# Altium schematic sheet uARM.SchDoc: UARM
size OrCAD B; CheckedBy: KEVIN COTTON ING; Author: SAMUEL DUCLOS; CompanyName: CEGEP LIMOILOU; DrawnBy: SAMUEL DUCLOS; Organization: CEGEP LIMOILOU; Revision: A
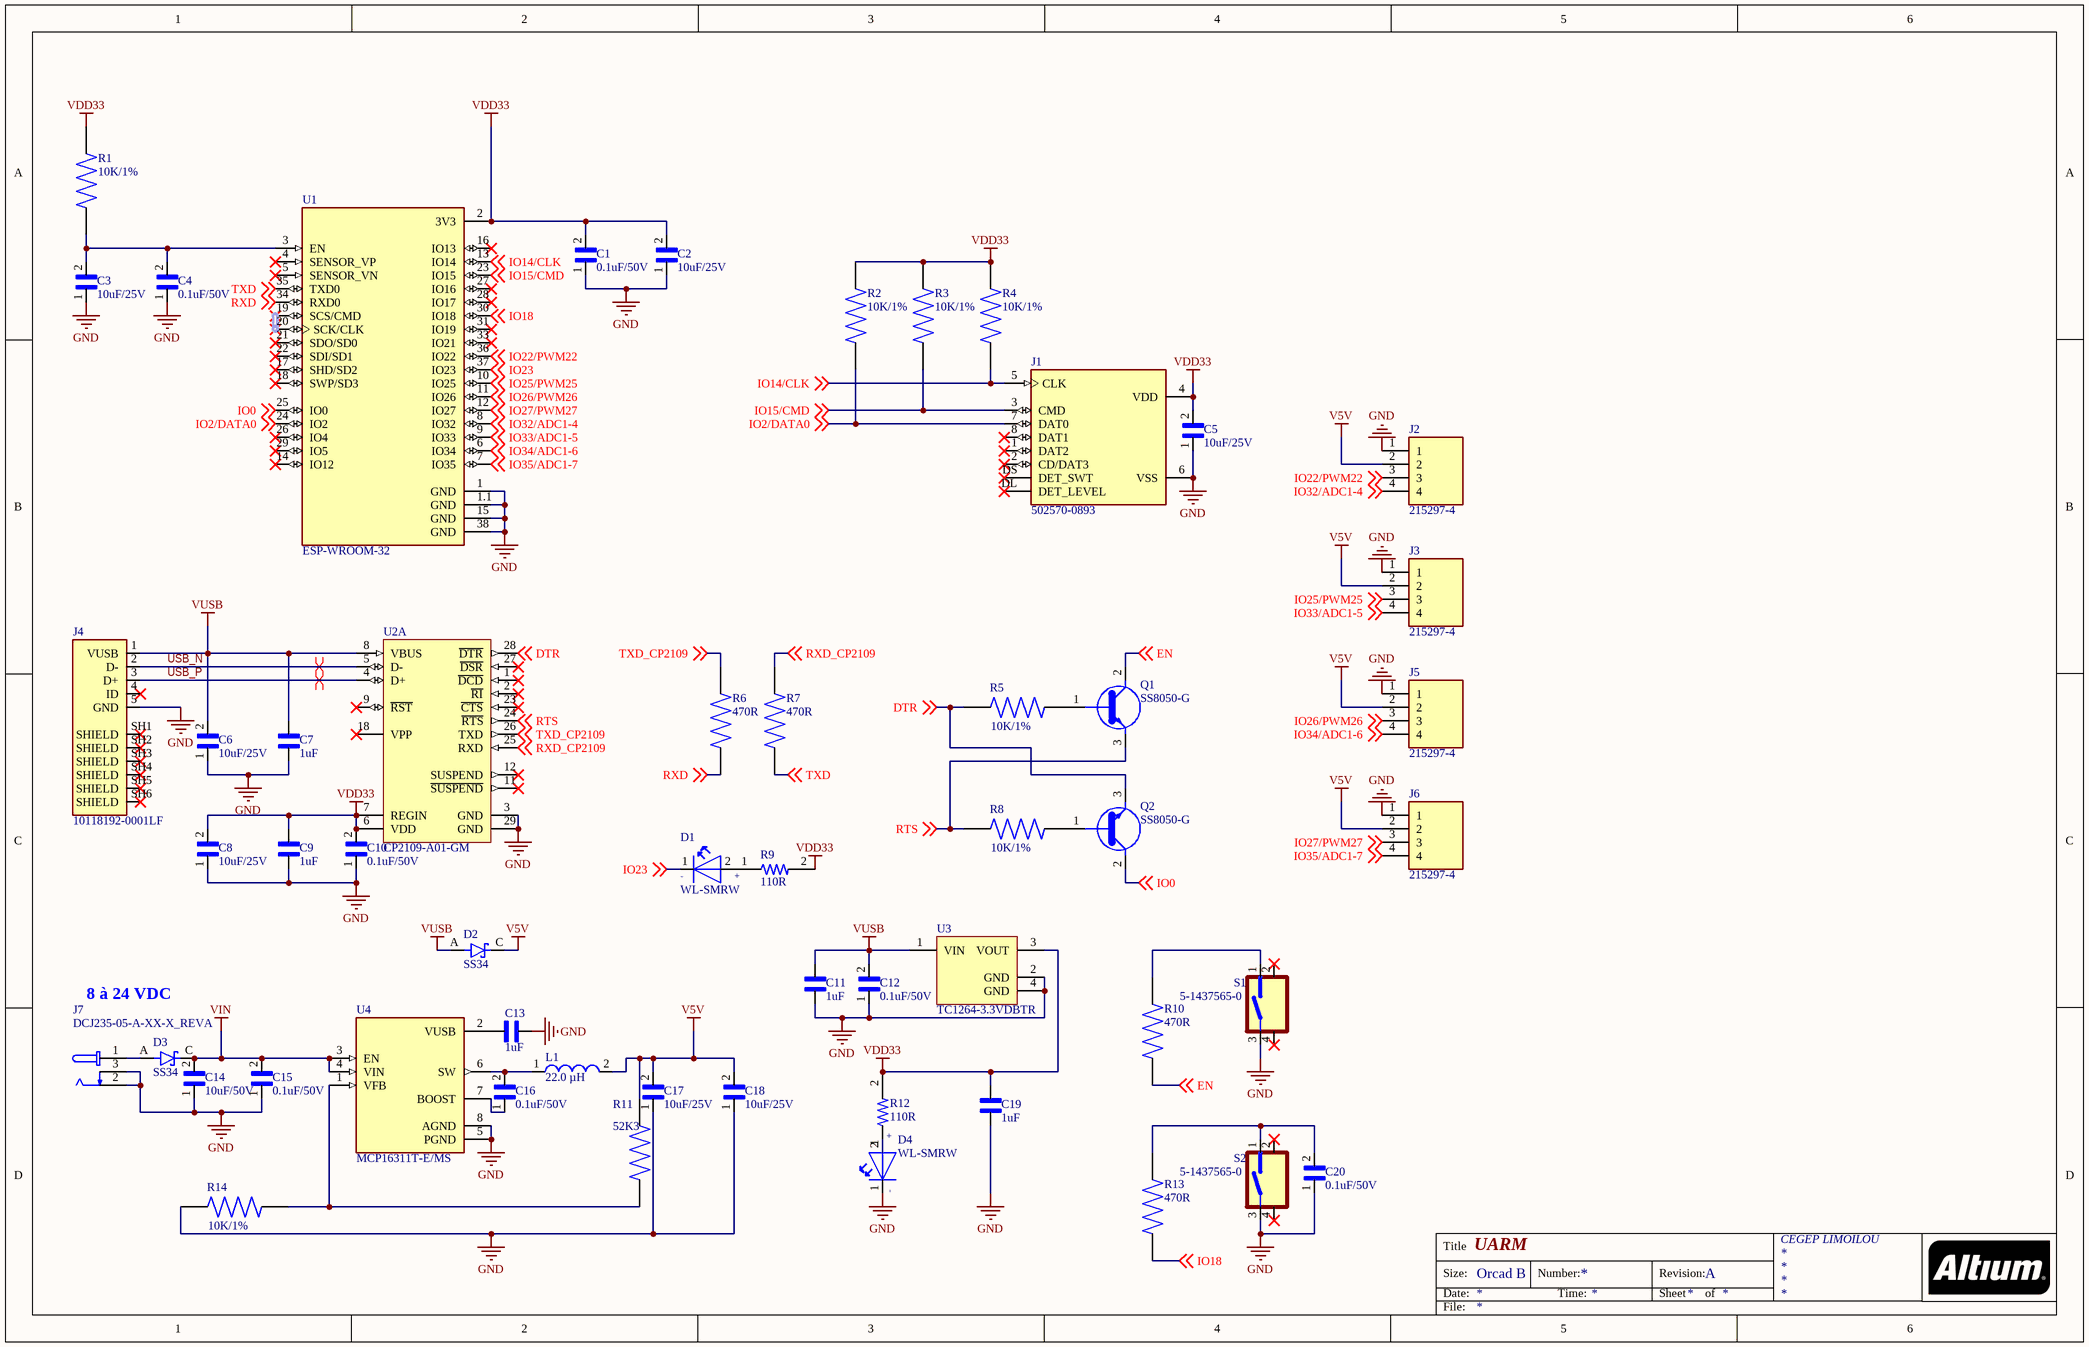
[diagram p0: uARM.SchDoc]

## Parts
C1  value 0.1uF/50V  [CAPC2012X94N]  (hidden comment: 08055C104KAT4A)
C2  value 10uF/25V  [CAPC2012X135N]  (hidden comment: CL21A106KAYNNNE)
C3  value 10uF/25V  [CAPC2012X135N]  (hidden comment: CL21A106KAYNNNE)
C4  value 0.1uF/50V  [CAPC2012X94N]  (hidden comment: 08055C104KAT4A)
C5  value 10uF/25V  [CAPC2012X135N]  (hidden comment: CL21A106KAYNNNE)
C6  value 10uF/25V  [CAPC2012X135N]  (hidden comment: CL21A106KAYNNNE)
C7  value 1uF  [WCAP-CSGP_885012207022]  (hidden comment: 885012207022)
C8  value 10uF/25V  [CAPC2012X135N]  (hidden comment: CL21A106KAYNNNE)
C9  value 1uF  [WCAP-CSGP_885012207022]  (hidden comment: 885012207022)
C10  value 0.1uF/50V  [CAPC2012X94N]  (hidden comment: 08055C104KAT4A)
C11  value 1uF  [WCAP-CSGP_885012207022]  (hidden comment: 885012207022)
C12  value 0.1uF/50V  [CAPC2012X94N]  (hidden comment: 08055C104KAT4A)
C13  value 1uF  [WCAP-CSGP_885012207022]  (hidden comment: 885012207022)
C14  value 10uF/50V  [CAPC2012X145N]  (hidden comment: GRM21BR61H106KE43L)
C15  value 0.1uF/50V  [CAPC2012X94N]  (hidden comment: 08055C104KAT4A)
C16  value 0.1uF/50V  [CAPC2012X94N]  (hidden comment: 08055C104KAT4A)
C17  value 10uF/25V  [CAPC2012X135N]  (hidden comment: CL21A106KAYNNNE)
C18  value 10uF/25V  [CAPC2012X135N]  (hidden comment: CL21A106KAYNNNE)
C19  value 1uF  [WCAP-CSGP_885012207022]  (hidden comment: 885012207022)
C20  value 0.1uF/50V  [CAPC2012X94N]  (hidden comment: 08055C104KAT4A)
D1  WL-SMRW  [WL-SMRW-1206-RECT]
D2  SS34  [DIOM7959X265N]
D3  SS34  [DIOM7959X265N]
D4  WL-SMRW  [WL-SMRW-1206-RECT]
J1  502570-0893  [MOLEX_502570-0893]
J2  215297-4  [TE_215297-4]
J3  215297-4  [TE_215297-4]
J4  10118192-0001LF  [AMPHENOL_10118192-0001LF]
J5  215297-4  [TE_215297-4]
J6  215297-4  [TE_215297-4]
J7  DCJ235-05-A-XX-X_REVA  [GCT_DCJ235-05-A-XX-X_REVA]
L1  Inductance: 22.0 µH  [WE-PD2-S]  (hidden comment: 744773122)
Q1  SS8050-G  [MBTB-T-SOT23]
Q2  SS8050-G  [MBTB-T-SOT23]
R1  value 10K/1%  [RESC2012X65N]  (hidden comment: ESR10EZPF1002)
R2  value 10K/1%  [RESC2012X65N]  (hidden comment: ESR10EZPF1002)
R3  value 10K/1%  [RESC2012X65N]  (hidden comment: ESR10EZPF1002)
R4  value 10K/1%  [RESC2012X65N]  (hidden comment: ESR10EZPF1002)
R5  value 10K/1%  [RESC2012X65N]  (hidden comment: ESR10EZPF1002)
R6  value 470R  [RESC2012X70N]  (hidden comment: ERJ-PB6B4700V)
R7  value 470R  [RESC2012X70N]  (hidden comment: ERJ-PB6B4700V)
R8  value 10K/1%  [RESC2012X65N]  (hidden comment: ESR10EZPF1002)
R9  value 110R  [RESCAV127P508X200X70-8N]  (hidden comment: RK73H2ATTD1100F)
R10  value 470R  [RESC2012X70N]  (hidden comment: ERJ-PB6B4700V)
R11  value 52K3  [RESC0603X26N]  (hidden comment: ERJ-1GEF5232C)
R12  value 110R  [RESCAV127P508X200X70-8N]  (hidden comment: RK73H2ATTD1100F)
R13  value 470R  [RESC2012X70N]  (hidden comment: ERJ-PB6B4700V)
R14  value 10K/1%  [RESC2012X65N]  (hidden comment: ESR10EZPF1002)
S1  5-1437565-0  [SW_5-1437565-0]
S2  5-1437565-0  [SW_5-1437565-0]
U1  ESP-WROOM-32  [MODULE_ESP-WROOM-32]
U2  CP2109-A01-GM  [SLAB-QFN-28-3125x3125TP_L]  (part A of 2)
U3  TC1264-3.3VDBTR  [SOT-223-DB3_L]
U4  MCP16311T-E/MS  [SOP65P490X110-8N]

## Nets
GND: C1.1 C2.1 C3.1 C4.1 C5.1 C6.1 C7.2 C8.1 C9.2 C10.1 C11.2 C12.1 C13.1 C14.1 C15.1 C17.1 C18.1 C19.2 C20.1 D4.1(NEG) J1.6(VSS) J2.1 J3.1 J4.5(GND) J5.1 J6.1 J7.2 J7.3 R14.1 S1.3 S2.3 U1.1(GND) U1.1.1(GND) U1.15(GND) U1.38(GND) U2.3(GND) U2.29(GND) U3.2(GND) U3.4(GND) U4.5(PGND) U4.8(AGND)
V5V: C17.2 C18.2 D2.C(K) J2.2 J3.2 J5.2 J6.2 L1.2 R11.2
VDD33: C1.2 C2.2 C5.2 C8.2 C9.1 C10.2 C19.1 J1.4(VDD) R1.2 R2.2 R3.2 R4.2 R9.2 R12.2 U1.2(3V3) U2.6(VDD) U2.7(REGIN) U3.3(VOUT)
VIN: C14.2 C15.2 D3.C(K) U4.3(EN) U4.4(VIN)
VUSB: C6.2 C7.1 C11.1 C12.2 D2.A J4.1(VUSB) U2.8(VBUS) U3.1(VIN)
DTR: Q2.3(C) R5.1 U2.28(~{DTR}) ; off-sheet DTR
EN: Q1.2(E) R10.1 ; off-sheet EN
IO0: Q2.2(E) U1.25(IO0) ; off-sheet IO0
IO2/DATA0: J1.7(DAT0) R2.1 U1.24(IO2) ; off-sheet IO2/DATA0
IO14/CLK: J1.5(CLK) R4.1 U1.13(IO14) ; off-sheet IO14/CLK
IO15/CMD: J1.3(CMD) R3.1 U1.23(IO15) ; off-sheet IO15/CMD
IO18: R13.1 U1.30(IO18) ; off-sheet IO18
IO22/PWM22: J2.3 U1.36(IO22) ; off-sheet IO22/PWM22
IO23: D1.1(NEG) U1.37(IO23) ; off-sheet IO23
IO25/PWM25: J3.3 U1.10(IO25) ; off-sheet IO25/PWM25
IO26/PWM26: J5.3 U1.11(IO26) ; off-sheet IO26/PWM26
IO27/PWM27: J6.3 U1.12(IO27) ; off-sheet IO27/PWM27
IO32/ADC1-4: J2.4 U1.8(IO32) ; off-sheet IO32/ADC1-4
IO33/ADC1-5: J3.4 U1.9(IO33) ; off-sheet IO33/ADC1-5
IO34/ADC1-6: J5.4 U1.6(IO34) ; off-sheet IO34/ADC1-6
IO35/ADC1-7: J6.4 U1.7(IO35) ; off-sheet IO35/ADC1-7
RTS: Q1.3(C) R8.1 U2.24(~{RTS}) ; off-sheet RTS
RXD: R6.1 U1.34(RXD0) ; off-sheet RXD
RXD_CP2109: R7.2 U2.25(RXD) ; off-sheet RXD_CP2109
TXD: R7.1 U1.35(TXD0) ; off-sheet TXD
TXD_CP2109: R6.2 U2.26(TXD) ; off-sheet TXD_CP2109
USB_N: J4.2(D-) U2.5(D-)
USB_P: J4.3(D+) U2.4(D+)
NetC3_2: C3.2 C4.2 R1.1 U1.3(EN)
NetC13_2: C13.2 U4.2(VUSB)
NetC16_1: C16.1 U4.7(BOOST)
NetC16_2: C16.2 L1.1 U4.6(SW)
NetC20_2: C20.2 R13.2 S2.1
NetD1_2: D1.2(POS) R9.1
NetD3_A: D3.A J7.1
NetD4_2: D4.2(POS) R12.1
NetQ1_1: Q1.1(B) R5.2
NetQ2_1: Q2.1(B) R8.2
NetR10_2: R10.2 S1.1
NetR11_1: R11.1 R14.2 U4.1(VFB)

Not connected (* = marked no-connect by the designer): J1 1(DAT2)* 2(CD/DAT3)* 8(DAT1)* DL(DET_LEVEL)* DS(DET_SWT)*; J4 4(ID)* SH1(SHIELD)* SH2(SHIELD)* SH3(SHIELD)* SH4(SHIELD)* SH5(SHIELD)* SH6(SHIELD)*; S1 2* 4(1)*; S2 2* 4(1)*; U1 4(SENSOR_VP)* 5(SENSOR_VN)* 14(IO12)* 16(IO13)* 17(SHD/SD2)* 18(SWP/SD3)* 19(SCS/CMD)* 20(SCK/CLK)* 21(SDO/SD0)* 22(SDI/SD1)* 26(IO4)* 27(IO16)* 28(IO17)* 29(IO5)* 31(IO19)* 33(IO21)*; U2 1(~{DCD})* 2(~{RI})* 9(~{RST})* 11(~{SUSPEND})* 12(SUSPEND)* 18(VPP)* 23(~{CTS})* 27(~{DSR})*

## Layout directives
differential pair: USB_N, USB_P

## Notes on the sheet
- 8 à 24 VDC
- Title
- Size:
- Date:
- Orcad B
- Number:
- Time:
- Revision:
- Sheet
- of
- File:
- (in symbol WL-SMRW) -; +

## Library data of the parts
C1 C4 C10 C12 C15 C16 C20 = 08055C104KAT4A: .1UF 50V 10% 0805; MF: {'manufacturer': u'AVX'}; Price: None; Package: None; Availability: Unavailable; MP: 08055C104KAT4A
C2 C3 C5 C6 C8 C17 C18 = CL21A106KAYNNNE: Cap Ceramic 10uF 25V X5R 10% SMD 0805 85Â°C Embossed T/R; MF: {'manufacturer': u'Samsung'}; MP: CL21A106KAYNNNE; Package: None; Availability: Unavailable; Price: None
C7 C9 C11 C13 C19 = 885012207022: <b> WCAP-CSGP Ceramic Capacitors <br> <br> <br><b>Characteristics </b><br> </b><br>Multilayer Ceramic Chip Capacitor <br>Recommended soldering:Reflow, for 0603 and 0805 wave soldering is also allowed <br>Operating temperature:-55 Â°C to +125 Â°C; <br>Ceramic characteristics: Class I - NPO ; Class II -X7R, X5R <br>High performance ceramic <br>High capacitance stability <br>Minimal aging  <br>Termination:Cu/Ni/Sn <br>   <br><a href="http://katalog.we-online.de/media/images/eisos/WCAP-CSGP_pf2.jpg" title="Enlarge picture"> <img src="http://katalog.we-online.de/media/thumbs2/eisos/thb_WCAP-CSGP_pf2.jpg" width="320"></a><p> Details see: <a href="http://katalog.we-online.de/en/pbs/WCAP-CSGP-0805?">http://katalog.we-online.de/en/pbs/WCAP-CSGP-0805? </a><p>Created:  2015-01-28 <br>2015 (C) Wurth Elektronik; MF: {'manufacturer': u'Wurth Electronics Inc'}; Price: None; MP: 885012207022; Availability: Unavailable; Package: None
C14 = GRM21BR61H106KE43L: SMD Capacitor X5R(EIA) with Capacitance: 10uF Tol. 10%. Rated Voltage: 50Vdc; MF: {'manufacturer': u'Murata Electronics'}; MP: GRM21BR61H106KE43L; Package: None; Availability: Unavailable; Price: None
D1 D4 = WL-SMRW: <b>SMD Reverse mount mono-color rectangular <br> <br> <br><b> Characteristics <br><br></b></b> Small size & thin body for space saving  <br> Ideal for narrow space applications  <br> Wide viewing angle  <br> Low power consumption  <br> Industry standard footprint  <br> Small package for exceptional brightness <br> To emit light through a small cut-out hole in PCB  <br> Compatible with automatic placement machine <br>  <br><b> Applications  <br><br></b> Front panel indicators  <br> LCD backlighting  <br> Keypad backlighting  <br> Push button backlighting  <br> Symbol and switch backlighting  <br> General lighting <br> <br> <br> <br><a href="http://katalog.we-online.de/media/images/eipal/WL-SMRW_pf2.jpg" title="Enlarge picture"> <img src="http://katalog.we-online.de/media/thumbs2/eipal/thb_WL-SMRW_pf2.jpg" width="320"></a><p> Details see: <a href="http://katalog.we-online.de/en/led/WL-SMRW?m">http://katalog.we-online.de/en/led/WL-SMRW?m</a><p>  </b>Updated  2015-04-10<br> </b>2015 (C) Wurth Elektronik; MF: {'manufacturer': u'Wurth Electronics'}; Value: *; Price: None; Availability: Unavailable; MP: WL-SMRW; Package: None
D2 D3 = SS34: Diode Schottky 40V 3A 2-Pin SMC T/R; MF: {'manufacturer': u'ON Semiconductor'}; Availability: Unavailable; Package: None; MP: SS34; Value: *; Price: None
J1 = 502570-0893: <b>1.10mm Pitch microSD Memory Card Connector, Normal Mount Surface Mount, Push-Push Type</b><p>http://www.snapeda.com/parts/502570-0893/Molex/view-part/; MF: {'manufacturer': u'Molex'}; Price: None; Package: None; Availability: Unavailable; Value: *; MP: 502570-0893
J2 J3 J5 J6 = 215297-4: MF: {'manufacturer': u'TE Connectivity'}; Package: None; Price: None; Availability: Unavailable; MP: 215297-4; Value: *
J4 = 10118192-0001LF: Single Port 5 Contact Horizontal Right Angle Shielded Micro B USB 2.0 Connector; MF: {'manufacturer': u'FCI'}; Package: None; MP: 10118192-0001LF; Price: None; Value: *; Availability: Unavailable
J7 = DCJ235-05-A-XX-X_REVA: DC Power Jack, Thru-Hole, Horizontal, with Locating Pegs, D2.35mm; MF: {'manufacturer': u'Global Connector Technology'}; Availability: Unavailable; Package: None; Price: None; MP: DCJ235-05-A-XX-X_REVA; Value: *
L1 = 744773122: SMD Power Inductor WE-PD2, L = 22.0 µH; ComponentLink1Description: Manufacturer Link; ComponentLink2Description: Datasheet; DatasheetVersion: ver 1, Oct-2004; ComponentLink1URL: http://www.we-online.com; PackageVersion: 2004; PackageDescription: SMD Inductor, 2-Leads, Body 4.5 x 4.0 mm; ComponentLink2URL: http://www.we-online.de/katalog/media/pdf/744773122.pdf; PackageReference: WE-PD2-S; PartNumber: 744773122
Q1 Q2 = SS8050-G: <b>Bipolar Transistors - BJT NPN TRANSISTOR 1.5A 40V</b><p> Source: <a href="https://componentsearchengine.com/Datasheets/1/SS8050-G.pdf"> Datasheet </a>; MF: {'manufacturer': u'Comchip Technology'}; Package: None; Value: *; MP: SS8050-G; Availability: Unavailable; Price: None
R1-R5 R8 R14 = ESR10EZPF1002: RES SMD 10K OHM 1% 0.4W 0805; MF: {'manufacturer': u'Rohm'}; Price: None; Package: None; Availability: Unavailable; MP: ESR10EZPF1002
R6 R7 R10 R13 = ERJ-PB6B4700V: MF: {'manufacturer': u'Panasonic'}; Price: None; Availability: Unavailable; MP: ERJ-PB6B4700V; Package: None
R9 R12 = RK73H2ATTD1100F: Res Thick Film 0805 110 Ohm 1% 1/8W ?100ppm/C Molded SMD SMD Punched Paper T/R; MF: {'manufacturer': u'KOA Speer'}; MP: RK73H2ATTD1100F; Availability: Unavailable; Price: None; Package: None
R11 = ERJ-1GEF5232C: Res Thick Film 0201 52.3K Ohm 1% 0.05W(1/20W) Â±200ppm/C SMD T/R; MF: {'manufacturer': u'Panasonic'}; Package: None; MP: ERJ-1GEF5232C; Availability: Unavailable; Price: None
S1 S2 = 5-1437565-0: Switch Tactile OFF (ON) Round Button Gull Wing 0.05A 12VDC 1.57N SMD T/R; MF: {'manufacturer': u'TE Connectivity'}; MP: 5-1437565-0; Package: None; Price: None; Value: *; Availability: Unavailable
U1 = ESP-WROOM-32: Module: combo; GPIO, I2C x2, I2S x2, SDIO, SPI x3, UART x3; 19.5dBm; MF: {'manufacturer': u'Espressif Systems'}; Availability: Unavailable; MP: ESP-WROOM-32; Value: *; Price: None; Package: None
U2 = CP2109-A01-GM: Single-Chip USB to UART Bridge, 1024 Bytes EEPROM, -40 to 85 degC, 28-pin QFN, Tube; Manufacturer: Silicon Labs; Sub-Family: USB Bridges; Internal Oscillator: TRUE; ComponentLink1Description: Manufacturer URL; ComponentLink2Description: Datasheet; PartNumber: CP2109-A01-GM; ComponentLink3Description: Package Specification; ComponentLink3URL: http://www.silabs.com/Support%20Documents/TechnicalDocs/C8051T61x.pdf; DatasheetVersion: Rev. 1.5; ComponentLink1URL: http://www.silabs.com/; ComponentLink2URL: http://www.silabs.com/Support%20Documents/TechnicalDocs/CP2102-9.pdf; Code_IPC: J-STD-020C; Mounting Technology: Surface Mount; PackageDescription: 28-Pin Quad-Flat No-Leads Package, Body 5 x 5 mm, Pitch 0.5 mm; Code_JEDEC: MO-220; EEPROM: 1024 Bytes; PackageReference: QFN-28
U3 = TC1264-3.3VDBTR: 800 mA Fixed-Output CMOS LDO with Shutdown, 3-Pin SOT-223, Extended Temperature, Tape and Reel; PackageVersion: revBB, Aug-2009; PackageReference: SOT-223-DB3; PackageDescription: 3-Lead Plastic Small Outline Transistor (DB) [SOT-223]; DatasheetVersion: revC, Oct-2006; PartNumber: TC1264-3.3VDBTR
U4 = MCP16311T-E/MS: The MCP16311/2 is a compact, high-efficiency, fixed frequency, synchronous step-down DC-DC converter in an 8-pin MSOP, or 2 x 3 TDFN package that operates from input voltage sources up to 30V. Integrated features include a high-side and a low-side switch, fixed frequency peak current mode control, internal compensation, peak current limit and overtemperature protection. The MCP16311/2 provides all the active functions for local DC-DC conversion, with fast transient response and accurate regulation.; MF: {'manufacturer': u'Microchip Technology'}; MP: MCP16311T-E/MS; Value: *; Package: None; Price: None; Availability: Unavailable